# EasyEDA schematic thrust-measuring-stand-schematic-r1.0.json
TITLE: Thrust Measuring Stand; REV: 1.0; Date: 2022-08-08; Sheet: 1/1; Company: Lrocket
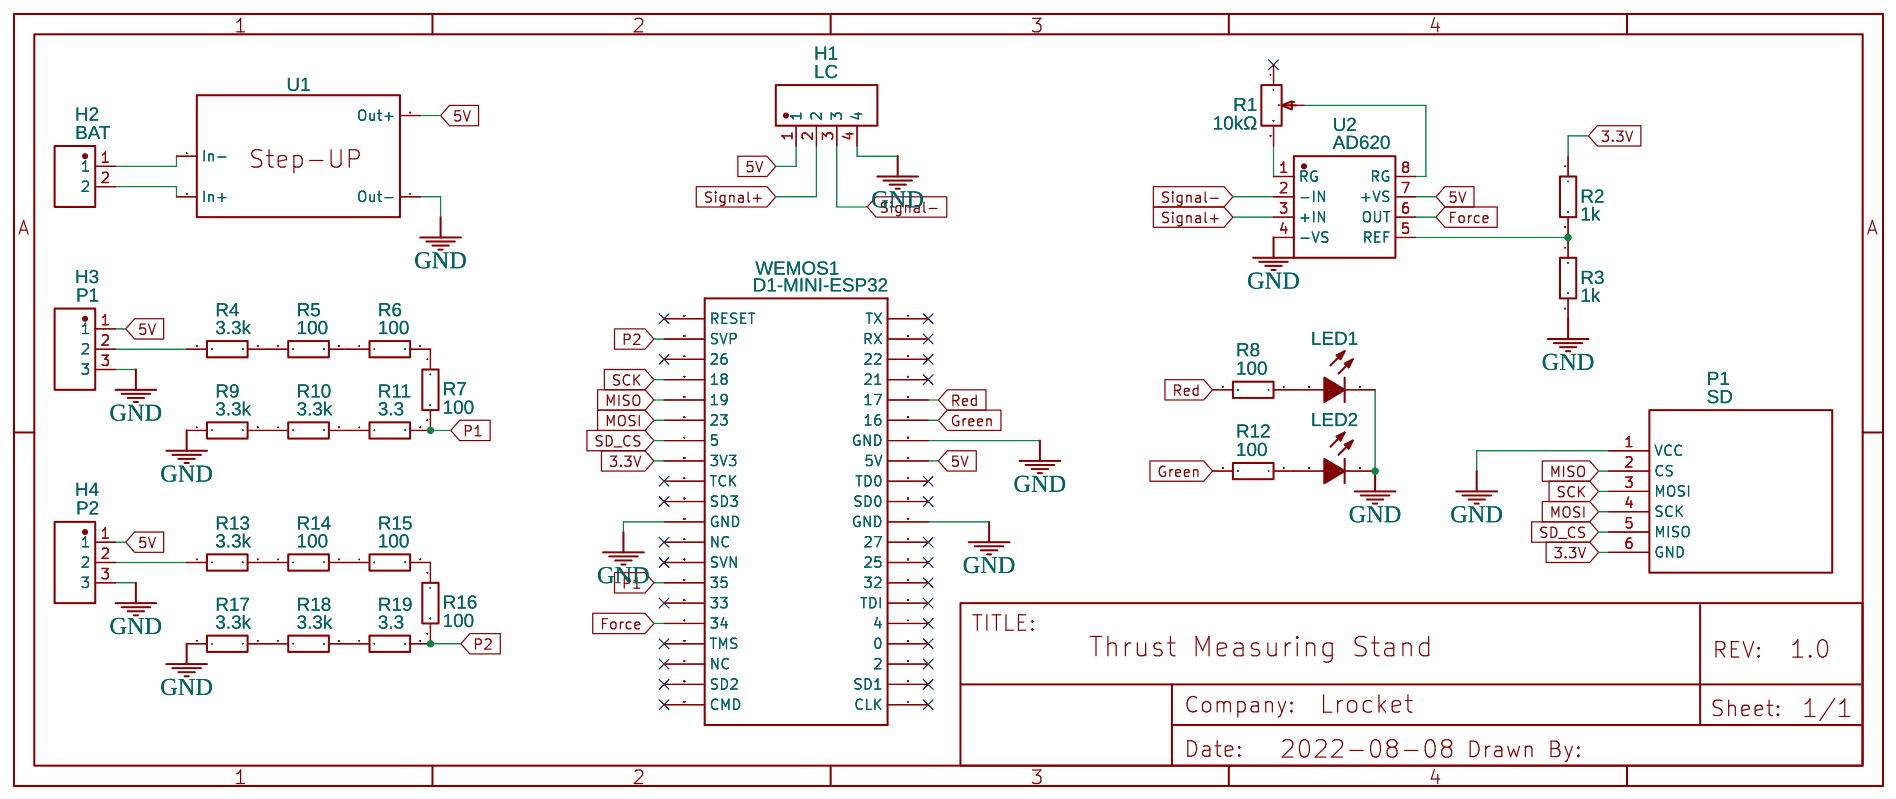
[diagram p0: schematic sheet]

## Parts
H1  LC  [HDR-TH_4P-P2.54-V-M]
H2  BAT  [HDR-TH_2P-P2.54-V-M]
H3  P1  [HDR-TH_3P-P2.54-V-F-3]
H4  P2  [HDR-TH_3P-P2.54-V-F-3]
LED1  Red  [LED-TH_BD5.9-P2.54-RD_RED]
LED2  Green  [LED-TH_BD5.9-P2.54-RD_RED]
P1  SD  [MICRO_SD_CARD_MODULE_3.3V]
R1  10kΩ  [RES-ADJ-TH_3296W]
R2  1k  [R0603]
R3  1k  [R0603]
R4  3.3k  [R0603]
R5  100  [R0603]
R6  100  [R0603]
R7  100  [R0603]
R8  100  [R0603]
R9  3.3k  [R0603]
R10  3.3k  [R0603]
R11  3.3  [R0603]
R12  100  [R0603]
R13  3.3k  [R0603]
R14  100  [R0603]
R15  100  [R0603]
R16  100  [R0603]
R17  3.3k  [R0603]
R18  3.3k  [R0603]
R19  3.3  [R0603]
U1  Mini Step-Up  [MINI STEP-UP]
U2  AD620  [DIP-8_L10.0-W6.5-P2.54-LS7.6-BL]
WEMOS1  D1-MINI-ESP32  [D1-MINI-ESP32_S]

## Library data of the parts
H1 = KH-2.54PH180-1X4P-L11.5: Supplier: LCSC; Supplier Part: C2905435; Manufacturer: kinghelm(金航标); Contributor: LCSC; JLCPCB Part Class: Extended Part
H2 = 1125-2102G0S110C005: Supplier: LCSC; Supplier Part: C721451; Manufacturer: Wcon; Contributor: LCSC; JLCPCB Part Class: Extended Part
H3 H4 = FH-00306: Supplier: LCSC; Supplier Part: C2685109; Manufacturer: Liansheng(连盛); Contributor: LCSC; JLCPCB Part Class: Extended Part
LED1 LED2 = 333-2SURD/S530-A3: Supplier: LCSC; Manufacturer: EVERLIGHT; Supplier Part: C87271; JLCPCB Part Class: Extended Part
P1 = Micro SD Card Module 3.3V V: sourceId: n1LFXQ8qk
R1 = 3296W-1-204_C330436: Supplier: LCSC; Supplier Part: C330436; Manufacturer: Chengdu Guosheng Tech; Manufacturer Part: 3296W-1-204; Resistance(Ohms): 200K; Contributor: LCSC; Resistance (Ohms): 200K; JLCPCB Part Class: Extended Part
R2-R19 = AECR0603F390KK9: Supplier: LCSC; Supplier Part: C352324; Manufacturer: ResistorToday; Resistance (Ohms): 390K; Contributor: LCSC; JLCPCB Part Class: Extended Part
U1 = Mini Step-Up: Supplier: DollaTek; Supplier Part: B08HQQ32M2; link: https://www.amazon.de/DollaTek-multifunktionales-DC-Lithium-Batterie-Boost-Modul-Step-Up-Board-Wandler-Spannungsregler/dp/B08HQQ32M2/ref=sr_1_1?__mk_de_DE=%C3%85M%C3%85%C5%BD%C3%95%C3%91&crid=2O2I95807AF6F&keywords=B08HQQ32M2&qid=1659960178&sprefix=b08hqq32m2%2Caps%2C59&sr=8-1; Contributor: dayaftereh11
U2 = AD620SQ/883B: Supplier: LCSC; Supplier Part: C514229; Manufacturer: Analog Devices; Contributor: LCSC; JLCPCB Part Class: Extended Part
WEMOS1 = D1-MINI-Esp32: WeMos.cc; Contributor: Mauro Manco (Exilaus)

## Nets
3.3V: P1.6(GND) R2.1 WEMOS1.3V3
5V: H1.1 H3.1 H4.1 U1.3(Out+) U2.7(+VS) WEMOS1.5V
GND: H1.4 H3.3 H4.3 LED1.1(C) LED2.1(C) P1.1(VCC) R3.2 R9.1 R17.1 U1.4(Out-) U2.4(-VS) WEMOS1.GND
Force: U2.6(OUT) WEMOS1.34
Green: R12.2 WEMOS1.16
MISO: P1.2(CS) WEMOS1.19
MOSI: P1.4(SCK) WEMOS1.23
P1: R7.2 R11.2 WEMOS1.35
P2: R16.2 R19.2 WEMOS1.SVP
Red: R8.2 WEMOS1.17
SCK: P1.3(MOSI) WEMOS1.18
SD_CS: P1.5(MISO) WEMOS1.5
Signal+: H1.2 U2.3(+IN)
Signal-: H1.3 U2.2(-IN)
Net-(H2-1): H2.1 U1.1(In-)
Net-(H2-2): H2.2 U1.2(In+)
Net-(H3-2): H3.2 R4.1
Net-(H4-2): H4.2 R13.1
Net-(LED1-2): LED1.2(A) R8.1
Net-(LED2-2): LED2.2(A) R12.1
Net-(R1-2): R1.2 U2.8(RG)
Net-(R1-3): R1.3 U2.1(RG)
Net-(R2-2): R2.2 R3.1 U2.5(REF)
Net-(R4-2): R4.2 R5.1
Net-(R5-2): R5.2 R6.1
Net-(R6-2): R6.2 R7.1
Net-(R9-2): R9.2 R10.1
Net-(R10-2): R10.2 R11.1
Net-(R13-2): R13.2 R14.1
Net-(R14-2): R14.2 R15.1
Net-(R15-2): R15.2 R16.1
Net-(R17-2): R17.2 R18.1
Net-(R18-2): R18.2 R19.1

Not connected (* = marked no-connect by the designer): R1 1*; WEMOS1 0* 2* 4* 21* 22* 25(27)* 26* 32* 33* CLK* CMD* NC* RESET* RX* SD0* SD1* SD2* SD3* SVN* TCK* TD0* TDI* TMS* TX*
